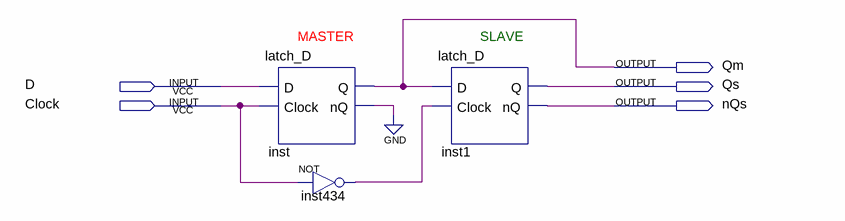
[diagram p0: schematic sheet]
// Quartus schematic ff_D_MS.bdf as structural Verilog: 3 symbols, 5 pins
module ff_D_MS (
  input  D,
  input  Clock,
  output Qm,
  output Qs,
  output nQs
);

  wire inst434_out, inst_nq;

  latch_D inst (.D(D), .Clock(Clock), .Q(Qm), .nQ(inst_nq));
  not inst434 (inst434_out, Clock);
  latch_D inst1 (.D(Qm), .Clock(inst434_out), .Q(Qs), .nQ(nQs));
  // also tied to GND on the sheet: inst_nq

  // Notes on the sheet:
  //   MASTER
  //   SLAVE
endmodule
